# Altium project SensorFimPapel.PrjPcb
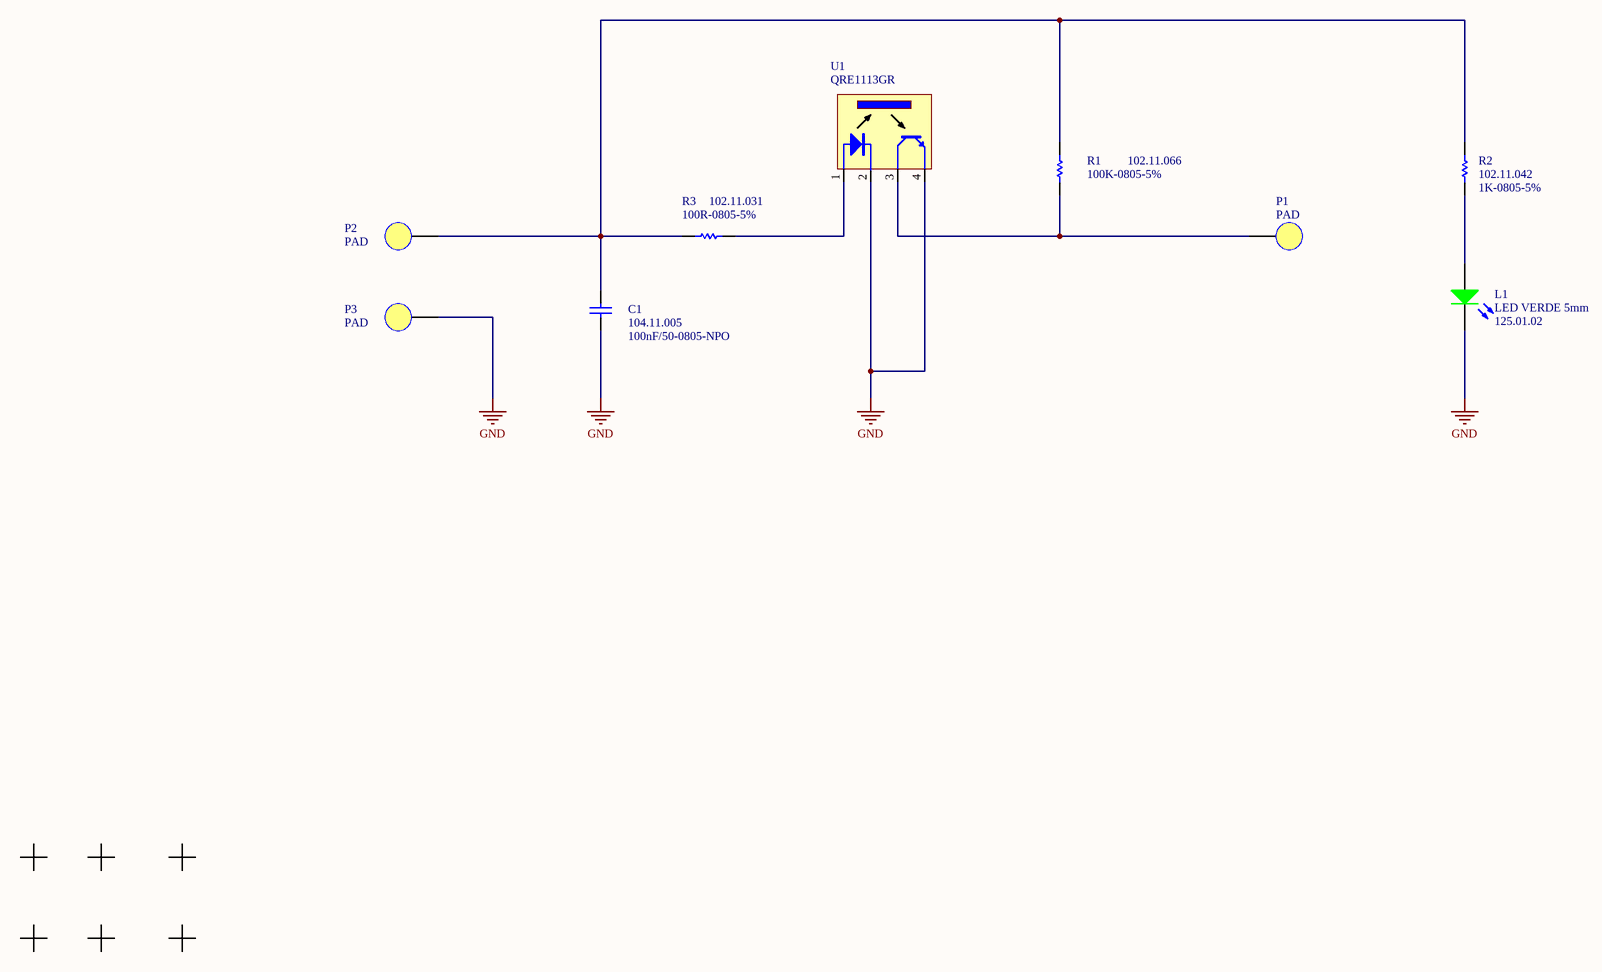
[diagram p0: SensorFimPapel.SchDoc]
1 sheet, 15 parts. Net scope: global (net labels, ports and power ports of the same name join across sheets).
Board files: SensorFimPapel.PcbDoc, Painel.PcbDoc

## Sheet SensorFimPapel.SchDoc
size A3

### Parts
C1  100nF/50-0805-NPO  ERP: 104.11.005  [0805-REVISADO ONDA]
FD1  FID  [FIDUCIAL]  (value not drawn)
FD2  FID  [FIDUCIAL]  (value not drawn)
FD3  FID  [FIDUCIAL]  (value not drawn)
FD4  FID  [FIDUCIAL]  (value not drawn)
FD5  FID  [FIDUCIAL]  (value not drawn)
FD6  FID  [FIDUCIAL]  (value not drawn)
L1  LED VERDE 5mm  ERP: 125.01.02  [LED 0805 - REVISADO ONDA]
P1  PAD  [PAD 3,5]
P2  PAD  [PAD 3,5]
P3  PAD  [PAD 3,5]
R1  100K-0805-5%  ERP: 102.11.066  [0805-REVISADO ONDA]
R2  1K-0805-5%  ERP: 102.11.042  [0805-REVISADO ONDA]
R3  100R-0805-5%  ERP: 102.11.031  [0805-REVISADO ONDA]
U1  QRE1113GR  [QR1113]

### Nets
GND: C1.1 L1.2(K) P3.1 U1.2(K) U1.4
NetC1_2: C1.2 P2.1 R1.2 R2.2 R3.1
NetL1_1: L1.1(A) R2.1
NetP1_1: P1.1 R1.1 U1.3
NetR3_2: R3.2 U1.1(A)

### Notes on the sheet
- NOME
- DATA
- PROJETO
- DESCRIÇÃO
- desenho
- verif.
- aprov.
- TAMANHO
- CODIGO
- Todas as informações disponíveis
- não devem ser divulgadas,
- em parte ou todo.
- CIRCUITO IMPRESSO
- MONTAGEM ELETRÔNICA
- A4
- de

### Library data of the parts
FD1-FD6 = FIDUCIAL